# Altium schematic sheet SOM-connectors.SchDoc
size 420 x 297 mm; SheetNumber: 5; SheetTotal: 6; ListNumber: 2
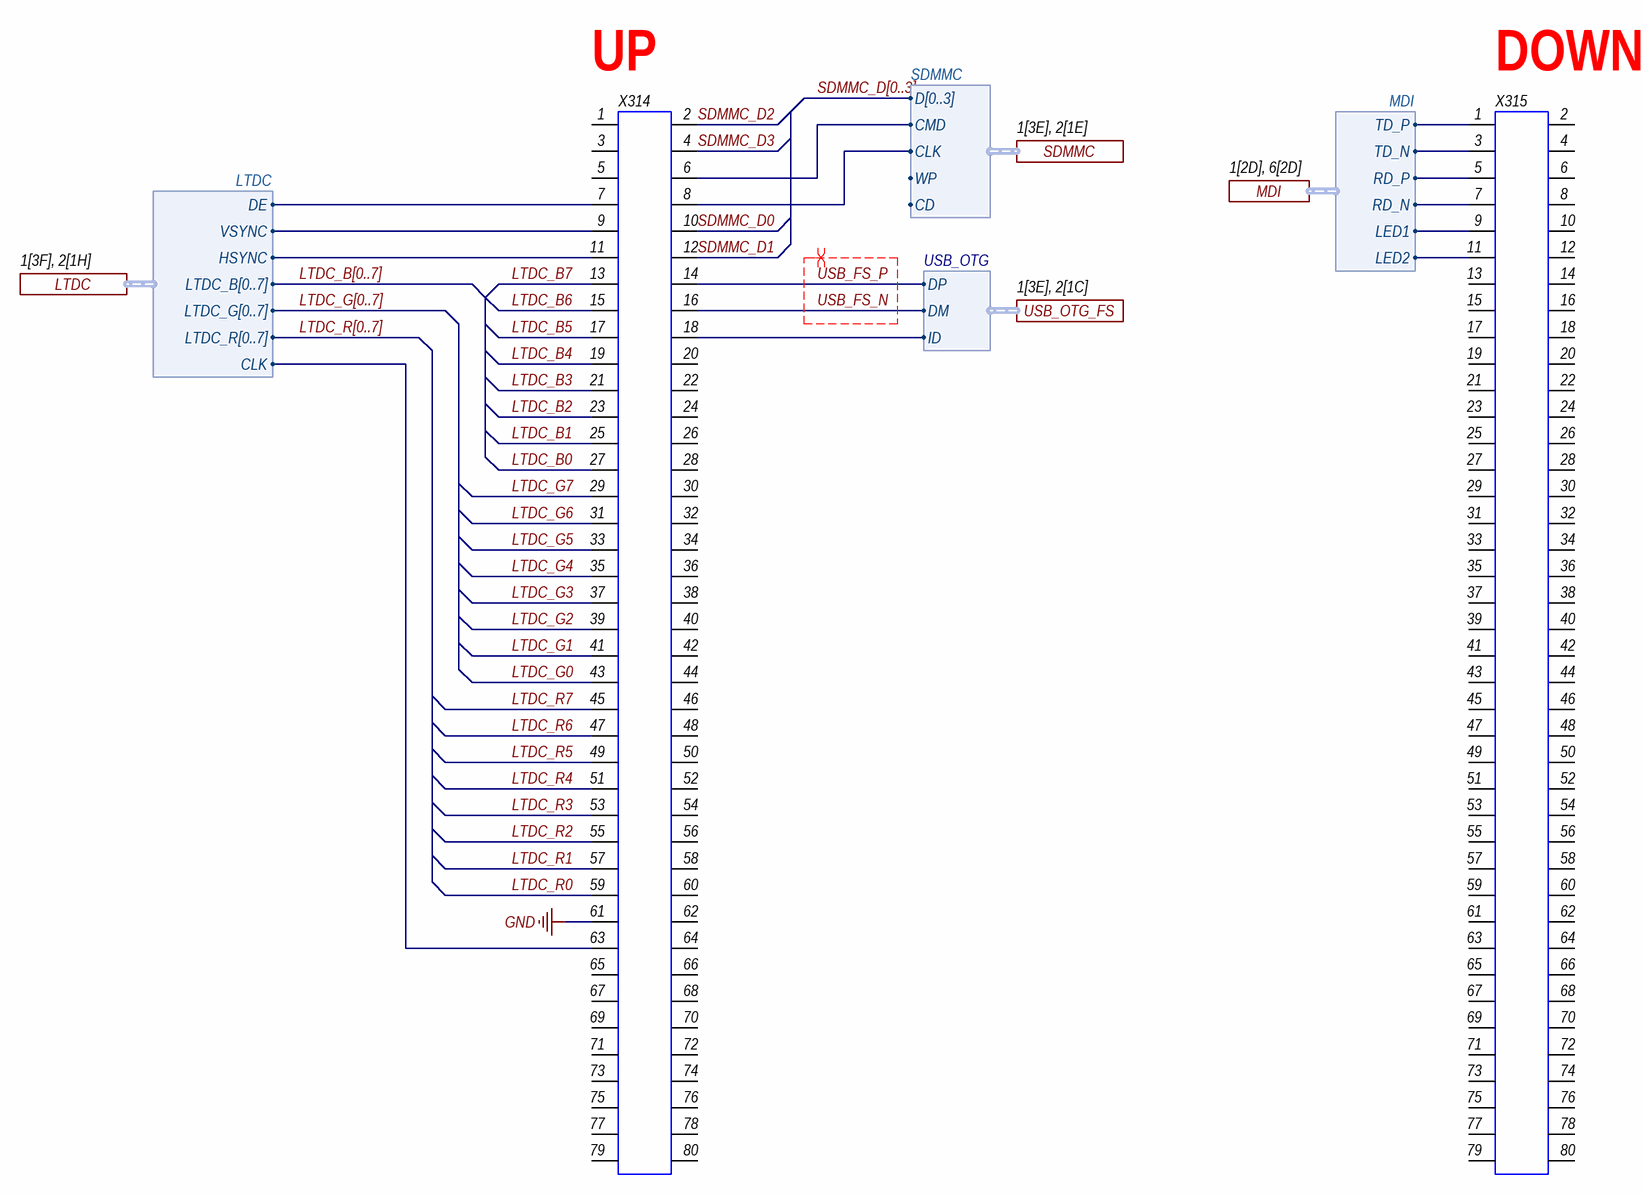
[diagram p0: SOM-connectors.SchDoc]

## Parts
X314  (no value)  [AXK6F80337YG]
X315  (no value)  [AXK6F80337YG]

## Ports
LTDC (harness LTDC, see 1[3F], 2[1H]), MDI (harness MDI, see 1[2D], 6[2D]), SDMMC (harness SDMMC, see 1[3E], 2[1E]), USB_OTG_FS (harness USB_OTG, see 1[3E], 2[1C])

## Harnesses
LTDC: CLK, DE, HSYNC, LTDC_B[0..7], LTDC_G[0..7], LTDC_R[0..7], VSYNC
MDI: TD_P, TD_N, RD_P, RD_N, LED1, LED2
SDMMC: CD, CLK, CMD, D[0..3], WP
USB_OTG: DP, DM, ID

## Nets
GND: X314.61
LTDC_B0: X314.27
LTDC_B1: X314.25
LTDC_B2: X314.23
LTDC_B3: X314.21
LTDC_B4: X314.19
LTDC_B5: X314.17
LTDC_B6: X314.15
LTDC_B7: X314.13
LTDC_G0: X314.43
LTDC_G1: X314.41
LTDC_G2: X314.39
LTDC_G3: X314.37
LTDC_G4: X314.35
LTDC_G5: X314.33
LTDC_G6: X314.31
LTDC_G7: X314.29
LTDC_R0: X314.59
LTDC_R1: X314.57
LTDC_R2: X314.55
LTDC_R3: X314.53
LTDC_R4: X314.51
LTDC_R5: X314.49
LTDC_R6: X314.47
LTDC_R7: X314.45
SDMMC_D0: X314.10
SDMMC_D1: X314.12
SDMMC_D2: X314.2
SDMMC_D3: X314.4
USB_FS_N: X314.16 ; port USB_OTG_FS.DM
USB_FS_P: X314.14 ; port USB_OTG_FS.DP
NetX314_6: X314.6 ; port SDMMC.CMD
NetX314_7: X314.7 ; port LTDC.DE
NetX314_8: X314.8 ; port SDMMC.CLK
NetX314_9: X314.9 ; port LTDC.VSYNC
NetX314_11: X314.11 ; port LTDC.HSYNC
NetX314_18: X314.18 ; port USB_OTG_FS.ID
NetX314_63: X314.63 ; port LTDC.CLK
NetX315_1: X315.1 ; port MDI.TD_P
NetX315_3: X315.3 ; port MDI.TD_N
NetX315_5: X315.5 ; port MDI.RD_P
NetX315_7: X315.7 ; port MDI.RD_N
NetX315_9: X315.9 ; port MDI.LED1
NetX315_11: X315.11 ; port MDI.LED2

Not connected (* = marked no-connect by the designer): X314 1 3 5 20 22 24 26 28 30 32 34 36 38 40 42 44 46 48 50 52 54 56 58 60 62 64 65 66 67 68 69 70 71 72 73 74 75 76 77 78 79 80; X315 2 4 6 8 10 12 13 14 15 16 17 18 19 20 21 22 23 24 25 26 27 28 29 30 31 32 33 34 35 36 37 38 39 40 41 42 43 44 45 46 47 48 49 50 51 52 53 54 55 56 57 58 59 60 61 62 63 64 65 66 67 68 69 70 71 72 73 74 75 76 77 78 79 80

## Buses and harness runs
bus LTDC_B[0..7]
bus LTDC_G[0..7]
bus LTDC_R[0..7]
bus SDMMC_D[0..3]

## Layout directives
differential pair: USB_FS_N, USB_FS_P

## Notes on the sheet
- (near X314) UP
- (near X315) DOWN
- Подп. и дата
- Инв. № дубл.
- Взам. инв. №
- Инв. № подл.
- Изм.
- Лист
- № докум.
- Подп.
- Дата
- Копировал
- Формат А3

## Library data of the parts
X314 X315 = AXK6F80337YG: Manufacturer: Philips Semi; Part Number: AXK6F80337YG; Device: AXK6F80337YG; Info: AXK6F80337YG; Pin Count: 80; Manufacturer Part Number: AXK6F80337YG; Type: Вилка